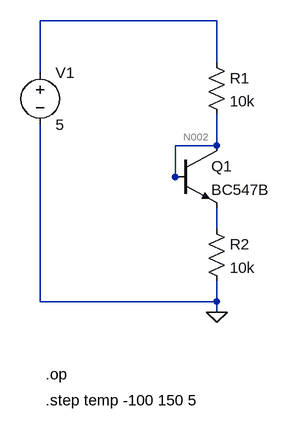
[diagram p0: schematic Draft1.asc]
Draft1.asc, the LTspice schematic file:
Version 4.1
SHEET 1 880 680
WIRE 224 -80 -48 -80
WIRE 224 -16 224 -80
WIRE -48 0 -48 -80
WIRE 224 112 224 64
WIRE 224 112 160 112
WIRE 160 160 160 112
WIRE 176 160 160 160
WIRE 224 240 224 208
WIRE -48 352 -48 80
WIRE 224 352 224 320
WIRE 224 352 -48 352
WIRE 224 368 224 352
FLAG 224 368 0
SYMBOL npn 160 112 R0
SYMATTR InstName Q1
SYMATTR Value BC547B
SYMBOL voltage -48 -16 R0
WINDOW 123 0 0 Left 0
WINDOW 39 0 0 Left 0
SYMATTR InstName V1
SYMATTR Value 5
SYMBOL res 208 -32 R0
SYMATTR InstName R1
SYMATTR Value 10k
SYMBOL res 208 224 R0
SYMATTR InstName R2
SYMATTR Value 10k
TEXT -40 504 Left 2 !.step temp -100 150 5
TEXT -40 464 Left 2 !.op

The netlist it stands for:
* Draft1.asc
Q1 N002 N002 N003 0 BC547B
V1 N001 0 5
R1 N001 N002 10k
R2 N003 0 10k
.model NPN NPN
.model PNP PNP
.lib standard.bjt
.step temp -100 150 5
.op
.backanno
.end

* Results of the author's LTspice run, read from the files saved beside the schematic
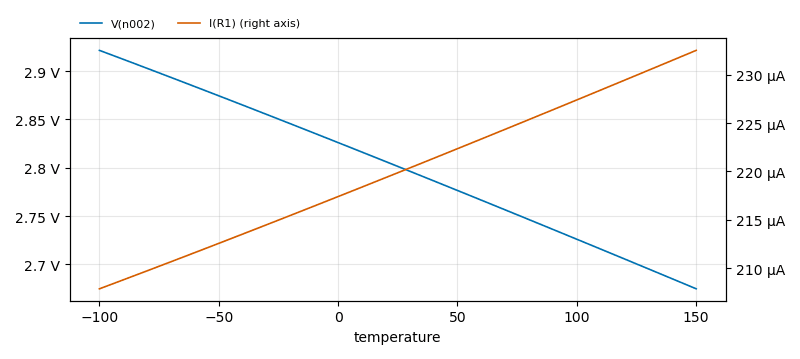
[diagram p1: Operating Point of Draft1.asc, plotted from the saved traces]
* Operating Point, 1 run:
*   V(n002): 2.922 V at temperature=-100 , 2.675 V at temperature=150 , min 2.675 V, max 2.922 V
*   I(R1): 207.8 µA at temperature=-100 , 232.5 µA at temperature=150 , min 207.8 µA, max 232.5 µA